# Altium schematic sheet Base Board.SchDoc
size A2; SheetNumber: 1; SheetTotal: 1
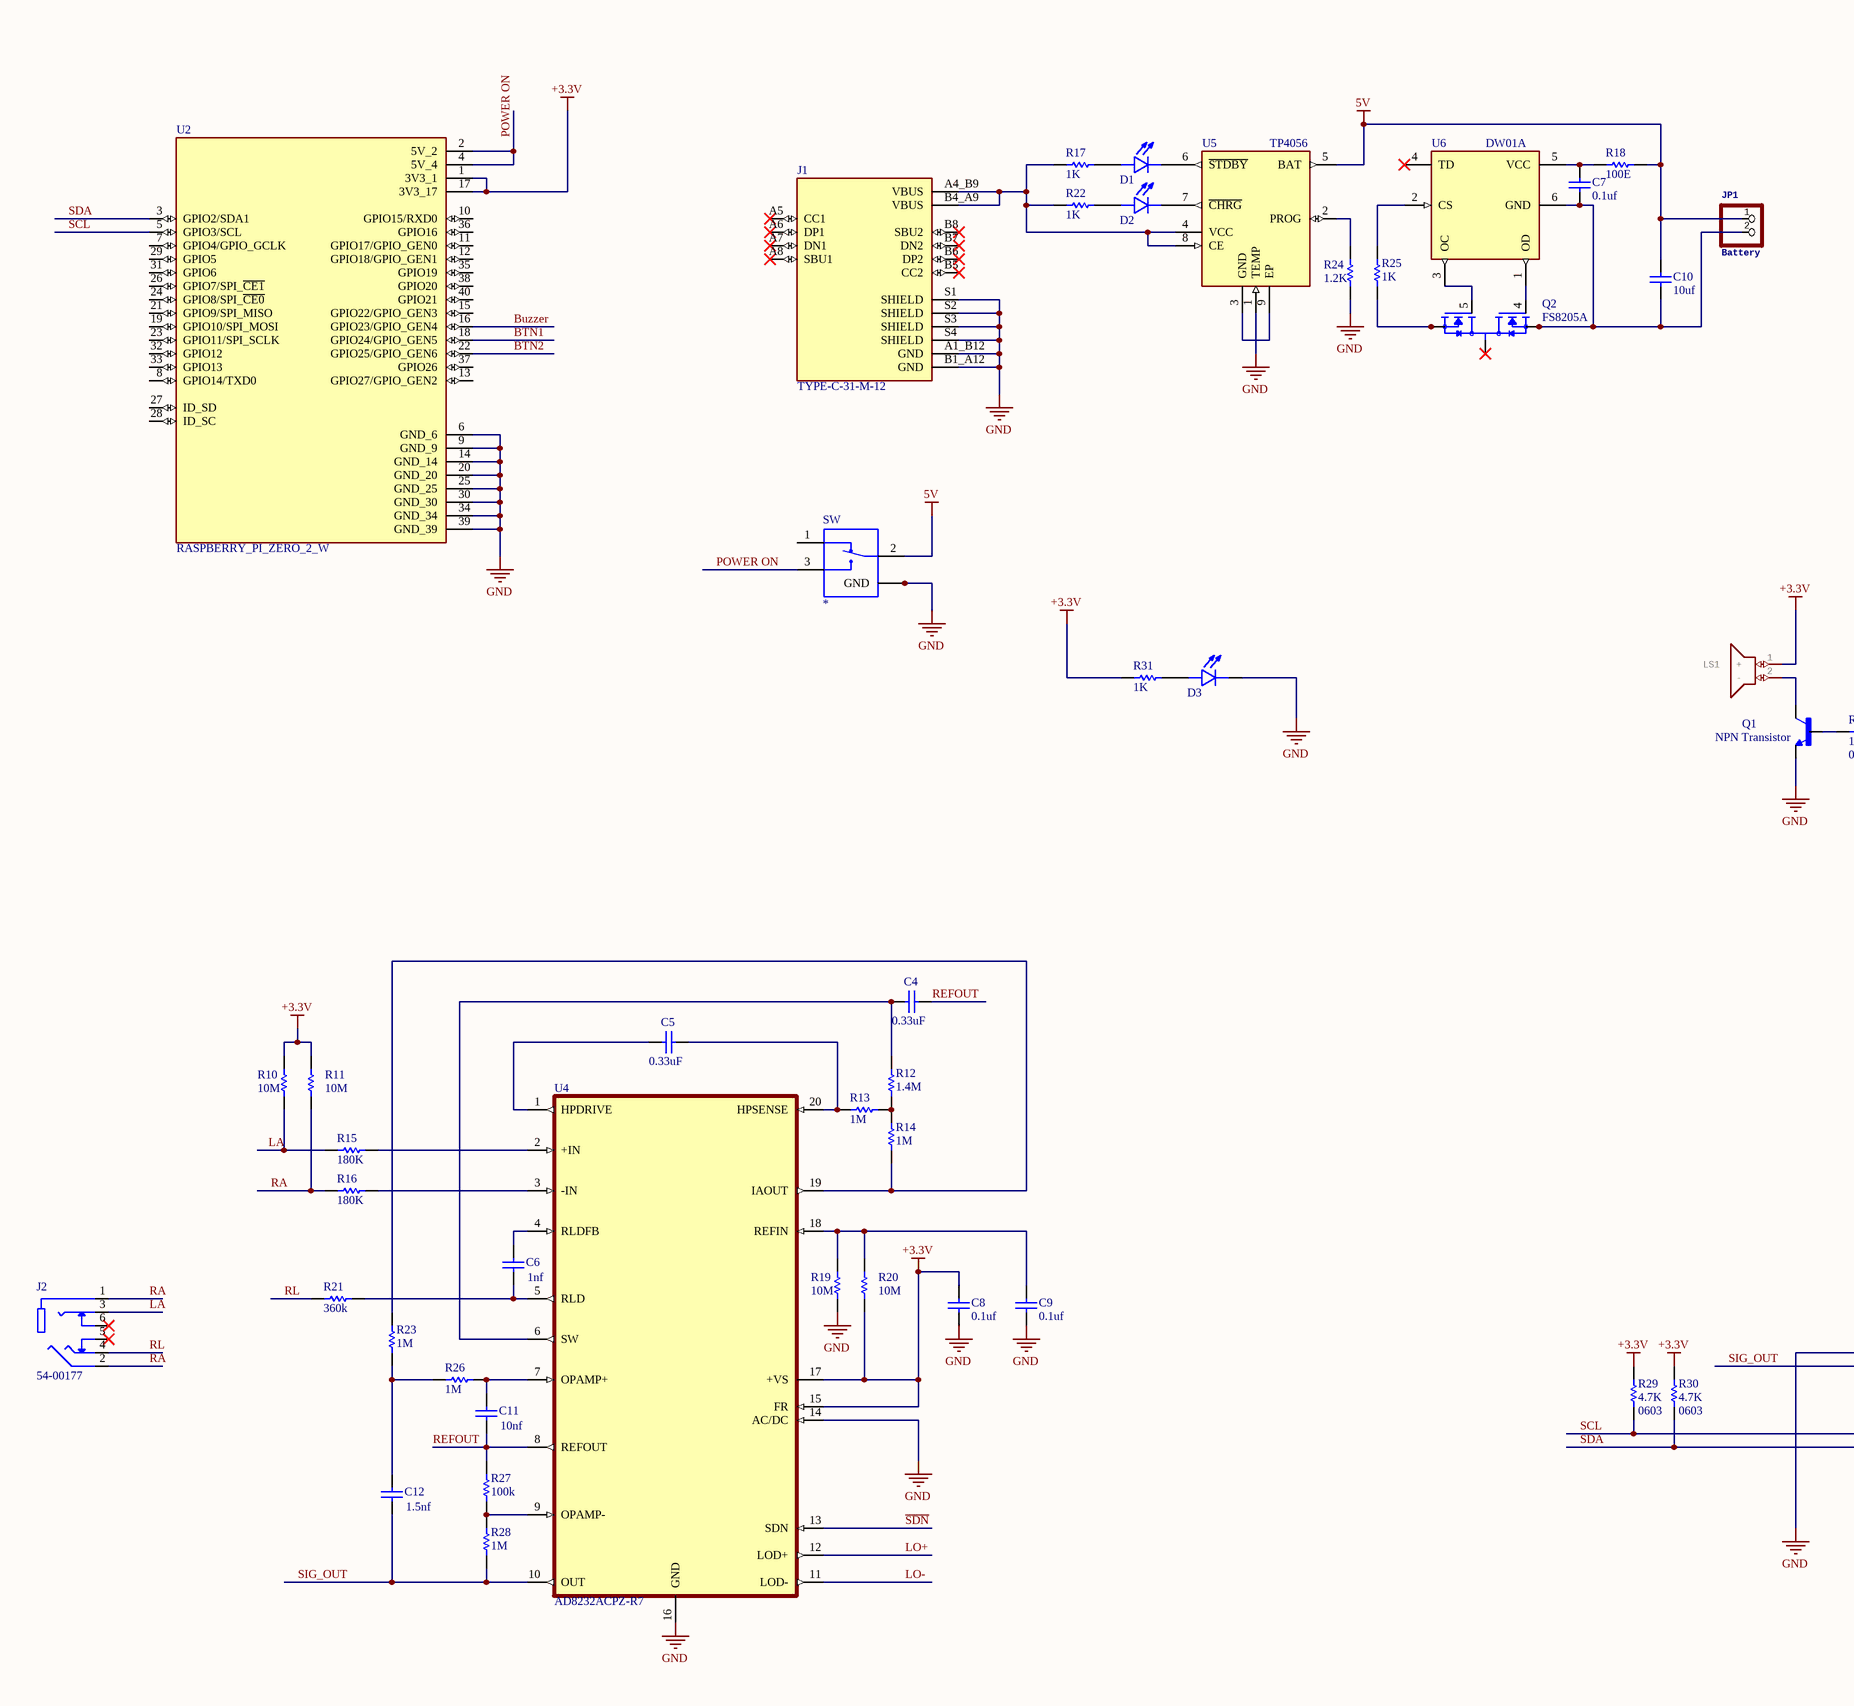
[diagram p0: Base Board.SchDoc, left]
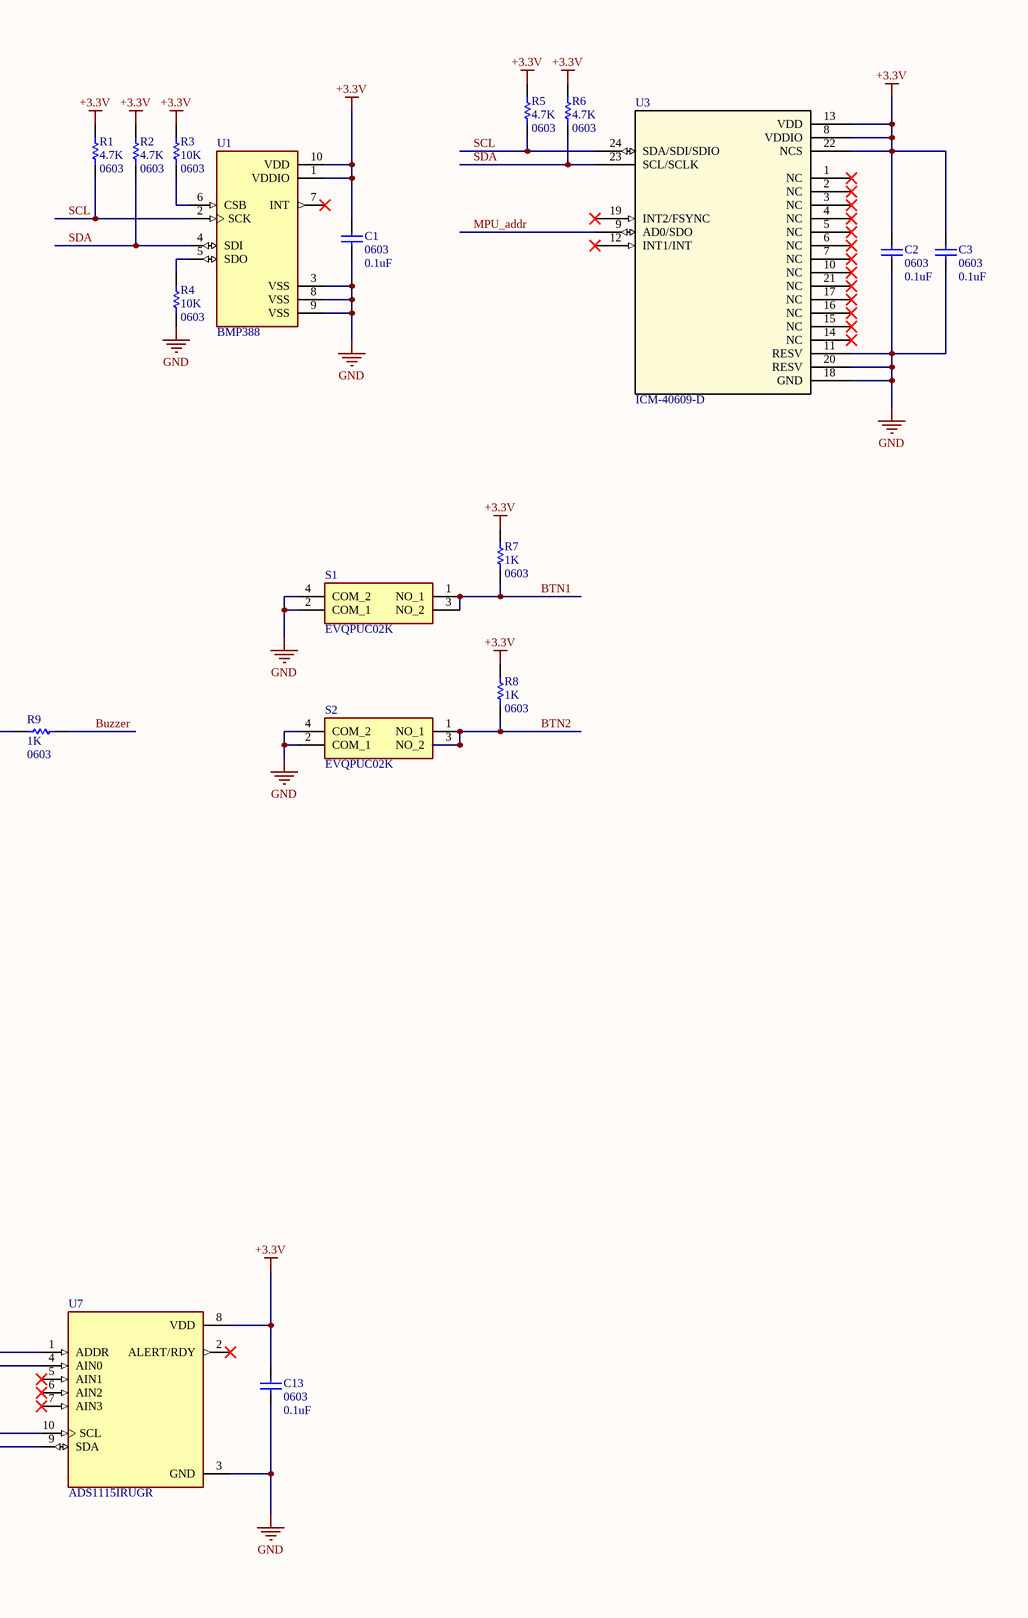
[diagram p1: Base Board.SchDoc, right]

## Parts
C1  Package: 0603  [CAPC1608X90]  (hidden comment: 0.1uF)
C2  Package: 0603  [CAPC1608X90]  (hidden comment: 0.1uF)
C3  Package: 0603  [CAPC1608X90]  (hidden comment: 0.1uF)
C4  0.33uF  [CAPC1608X90]
C5  0.33uF  [CAPC1608X90]
C6  1nf  [CAPC1608X90]
C7  0.1uf  [CAPC1608X90]
C8  0.1uf  [CAPC1608X90]
C9  0.1uf  [CAPC1608X90]
C10  10uf  [CAPC1608X90]
C11  10nf  [CAPC1608X90]
C12  1.5nf  [CAPC1608X90]
C13  Package: 0603  [CAPC1608X90]  (hidden comment: 0.1uF)
D1  KP-1608SURCK  [LED_KP-1608SURCK]  (value not drawn)
D2  KP-1608SURCK  [LED_KP-1608SURCK]  (value not drawn)
D3  KP-1608SURCK  [LED_KP-1608SURCK]  (value not drawn)
J1  TYPE-C-31-M-12  [HRO_TYPE-C-31-M-12]
J2  54-00177  [TENSILITY_54-00177]
JP1  Battery  [1X02]
LS1  Speakers & Transducers 9.0 mm square 1.9 mm deep P 4.0 kHz 3 V SMT no driving circuit T&R package B   Source:  Datasheet  [CPT9019BSMTTR]  (value not drawn)
Q1  NPN Transistor  [SOT100P230X110-3N]
Q2  FS8205A  [SOP65P640X120-8N]
R1  Package: 0603  [R0603]  (hidden comment: 4.7K)
R2  Package: 0603  [R0603]  (hidden comment: 4.7K)
R3  Package: 0603  [R0603]  (hidden comment: 10K)
R4  Package: 0603  [R0603]  (hidden comment: 10K)
R5  Package: 0603  [R0603]  (hidden comment: 4.7K)
R6  Package: 0603  [R0603]  (hidden comment: 4.7K)
R7  Package: 0603  [R0603]  (hidden comment: 1K)
R8  Package: 0603  [R0603]  (hidden comment: 1K)
R9  Package: 0603  [R0603]  (hidden comment: 1K)
R10  10M  [R0603]
R11  10M  [R0603]
R12  1.4M  [R0603]
R13  1M  [R0603]
R14  1M  [R0603]
R15  180K  [R0603]
R16  180K  [R0603]
R17  1K  [R0603]
R18  100E  [R0603]
R19  10M  [R0603]
R20  10M  [R0603]
R21  360k  [R0603]
R22  1K  [R0603]
R23  1M  [R0603]
R24  1.2K  [R0603]
R25  1K  [R0603]
R26  1M  [R0603]
R27  100k  [R0603]
R28  1M  [R0603]
R29  Package: 0603  [R0603]  (hidden comment: 4.7K)
R30  Package: 0603  [R0603]  (hidden comment: 4.7K)
R31  1K  [R0603]
S1  EVQPUC02K  [EVQPUC02K]
S2  EVQPUC02K  [EVQPUC02K]
SW  1437575-1  [SW_MLL1200S]  (value not drawn)
U1  BMP388  [PQFN50P200X200X80-10N]
U2  RASPBERRY_PI_ZERO_2_W  [MODULE_RASPBERRY_PI_ZERO_2_W]
U3  ICM-40609-D  [LGA24_ICM-40609_IVS]
U4  AD8232ACPZ-R7  [QFN50P400X400X100-21N]
U5  TP4056  [SOP127P600X175-9N]
U6  DW01A  [SOT95P280X145-6N]
U7  ADS1115IRUGR  [IC_ADS1115IRUGR]

## Nets
5V: C10.2 JP1.1 R18.1 SW.2 U5.5(BAT)
+3.3V: C1.1 C2.1 C3.1 C8.2 C13.1 LS1.1(+) R1.2 R2.2 R3.2 R5.2 R6.2 R7.1 R8.1 R10.1 R11.1 R20.2 R29.2 R30.2 R31.1 U1.1(VDDIO) U1.10(VDD) U2.1(3V3_1) U2.17(3V3_17) U3.8(VDDIO) U3.13(VDD) U3.22(NCS) U4.15(FR) U4.17(+VS) U7.8(VDD)
GND: C1.2 C2.2 C3.2 C8.1 C9.1 C13.2 D3.2(C) J1.A1_B12(GND) J1.B1_A12(GND) J1.S1(SHIELD) J1.S2(SHIELD) J1.S3(SHIELD) J1.S4(SHIELD) Q1.1(E) R4.1 R19.2 R24.1 S1.2(COM_1) S1.4(COM_2) S2.2(COM_1) S2.4(COM_2) SW.G1(GND) SW.G2(GND) SW.G3(GND) SW.G4(GND) U1.3(VSS) U1.8(VSS) U1.9(VSS) U2.6(GND_6) U2.9(GND_9) U2.14(GND_14) U2.20(GND_20) U2.25(GND_25) U2.30(GND_30) U2.34(GND_34) U2.39(GND_39) U3.11(RESV) U3.18(GND) U3.20(RESV) U4.14(AC/DC) U4.16(GND) U5.1(TEMP) U7.1(ADDR) U7.3(GND)
BTN1: R7.2 S1.1(NO_1) S1.3(NO_2) U2.18(GPIO24/GPIO_GEN5)
BTN2: R8.2 S2.1(NO_1) S2.3(NO_2) U2.22(GPIO25/GPIO_GEN6)
Buzzer: R9.1 U2.16(GPIO23/GPIO_GEN4)
LA: J2.3 R10.2 R15.2
LO+: U4.12(LOD+)
LO-: U4.11(LOD-)
MPU_addr: U3.9(AD0/SDO)
POWER ON: SW.3 U2.2(5V_2) U2.4(5V_4)
RA: J2.1 J2.2 R11.2 R16.2
REFOUT: C4.2 C11.1 R27.2 U4.8(REFOUT)
RL: J2.4 R21.2
~{SDN}: U4.13(SDN)
SCL: R1.1 R5.1 R29.1 U1.2(SCK) U2.5(GPIO3/SCL) U3.24(SDA/SDI/SDIO) U7.10(SCL)
SDA: R2.1 R6.1 R30.1 U1.4(SDI) U2.3(GPIO2/SDA1) U3.23(SCL/SCLK) U7.9(SDA)
SIG_OUT: C12.1 R28.1 U4.10(OUT) U7.4(AIN0)
NetC4_1: C4.1 R12.1 U4.6(SW)
NetC5_1: C5.1 U4.1(HPDRIVE)
NetC5_2: C5.2 R13.2 U4.20(HPSENSE)
NetC6_1: C6.1 R21.1 U4.5(RLD)
NetC6_2: C6.2 U4.4(RLDFB)
NetC7_1: C7.1 C10.1 JP1.2 Q2.2(S1) Q2.3(S1) U6.6(GND)
NetC7_2: C7.2 R18.2 U6.5(VCC)
NetC9_2: C9.2 R19.1 R20.1 U4.18(REFIN)
NetC11_2: C11.2 R26.2 U4.7(OPAMP+)
NetC12_2: C12.2 R23.1 R26.1
NetD1_1: D1.1(A) R17.2
NetD1_2: D1.2(C) U5.6(~{STDBY})
NetD2_1: D2.1(A) R22.2
NetD2_2: D2.2(C) U5.7(~{CHRG})
NetD3_1: D3.1(A) R31.2
NetJ1_A4_B9: J1.A4_B9(VBUS) J1.B4_A9(VBUS) R17.1 R22.1 U5.4(VCC) U5.8(CE)
NetLS1_2: LS1.2(-) Q1.3(C)
NetQ1_2: Q1.2(B) R9.2
NetQ2_1: Q2.1(D12) Q2.8(D12)
NetQ2_4: Q2.4(G1) U6.1(OD)
NetQ2_5: Q2.5(G2) U6.3(OC)
NetQ2_6: Q2.6(S2) Q2.7(S2) R25.1
NetR3_1: R3.1 U1.6(CSB)
NetR4_2: R4.2 U1.5(SDO)
NetR12_2: R12.2 R13.1 R14.2
NetR14_1: R14.1 R23.2 U4.19(IAOUT)
NetR15_1: R15.1 U4.2(+IN)
NetR16_1: R16.1 U4.3(-IN)
NetR24_2: R24.2 U5.2(PROG)
NetR25_2: R25.2 U6.2(CS)
NetR27_1: R27.1 R28.2 U4.9(OPAMP-)
NetU5_3: U5.3(GND) U5.9(EP)

Not connected (* = marked no-connect by the designer): J1 A5(CC1)* A6(DP1)* A7(DN1)* A8(SBU1)* B5(CC2)* B6(DP2)* B7(DN2)* B8(SBU2)*; J2 5* 6*; SW 1; U1 7(INT)*; U2 7(GPIO4/GPIO_GCLK) 8(GPIO14/TXD0) 10(GPIO15/RXD0) 11(GPIO17/GPIO_GEN0) 12(GPIO18/GPIO_GEN1) 13(GPIO27/GPIO_GEN2) 15(GPIO22/GPIO_GEN3) 19(GPIO10/SPI_MOSI) 21(GPIO9/SPI_MISO) 23(GPIO11/SPI_SCLK) 24(GPIO8/SPI_~{CE0}) 26(GPIO7/SPI_~{CE1}) 27(ID_SD) 28(ID_SC) 29(GPIO5) 31(GPIO6) 32(GPIO12) 33(GPIO13) 35(GPIO19) 36(GPIO16) 37(GPIO26) 38(GPIO20) 40(GPIO21); U3 1(NC)* 2(NC)* 3(NC)* 4(NC)* 5(NC)* 6(NC)* 7(NC)* 10(NC)* 12(INT1/INT)* 14(NC)* 15(NC)* 16(NC)* 17(NC)* 19(INT2/FSYNC)* 21(NC)*; U6 4(TD)*; U7 2(ALERT/RDY)* 5(AIN1)* 6(AIN2)* 7(AIN3)*

## Library data of the parts
C1-C3 C13 = C0603: MF: *; Digi-Key_Part_Number: *; MP: *; Value: 0.1uF
C4-C12 = C0603: MF: Murata Electronics; MP: GCM188R71C334KA37D; Digi-Key_Part_Number: 490-6050-2-ND; Package: 0603
  C4 C5: Value: 0.33uF
  C6: Value: 1nf
  C7-C9: Value: 0.1uf
  C10: Value: 10uf
  C11: Value: 10nf
  C12: Value: 1.5nf
D1-D3 = KP-1608SURCK: LED; SMD; 0603; red; 50-150mcd; 1.6x0.8mm; 120Â°; 20mA;; MF: Kingbright; SnapEDA_Link: https://www.snapeda.com/parts/KP-1608SURCK/Kingbright/view-part/?ref=snap; Package: 0603 Kingbright; Value: *; MP: KP-1608SURCK; Check_prices: https://www.snapeda.com/parts/KP-1608SURCK/Kingbright/view-part/?ref=eda
J1 = TYPE-C-31-M-12: USB Connectors 24 Receptacle 1 8.94*7.3mm RoHS; Manufacturer: HRO Electronics Co., Ltd.; Value: USB-C 16 pins; Other: USB 2 data interface; Man. PN: TYPE-C-31-M-12; Supplier: LCSC; Supplier PN: C165948
J2 = 54-00177: Connector, 4C audio jack, 3.5xL14 mm, SMT mount, gold plated; MF: Tensility International Corp; Package: None; Price: None; Check_prices: https://www.snapeda.com/parts/54-00177/Tensility+International+Corp/view-part/?ref=eda; Value: *; SnapEDA_Link: https://www.snapeda.com/parts/54-00177/Tensility+International+Corp/view-part/?ref=snap; MP: 54-00177; Availability: In Stock; Purchase-URL: https://pricing.snapeda.com/search?q=54-00177&ref=eda
JP1 = PINHD-1X2
LS1 = CPT-9019B-SMT-TR: Manufacturer_Name: Same Sky; GateName_1: G$1; SymbolName_1: CPT-9019B-SMT-TR; LibraryName: CPT-9019B-SMT-TR; DeviceSetName: CPT-9019B-SMT-TR; Package: CPT9019BSMTTR; Manufacturer_Part_Number: CPT-9019B-SMT-TR; Mouser_Part_Number: 179-CPT-9019B-SMT-TR; Mouser_Price-Stock: https://www.mouser.co.uk/ProductDetail/CUI-Devices/CPT-9019B-SMT-TR?qs=3Rah4i%252BhyCGQOzp5C27TLw%3D%3D; Height: 2.1mm
Q1 = BC847B: Bipolar (BJT) Transistor NPN 45V 100mA 100MHz 150mW Surface Mount SOT-523; Manufacturer1: STMicroelectronics; Package: None; Price: None; Availability: Unavailable; Manfacturer Part Number1: BC847B; Value: *
Q2 = FS8205A: N/A; MF: Fortune Semiconductor; MP: FS8205A; Value: *; Availability: Not in stock; Package: Package; Price: None; SnapEDA_Link: https://www.snapeda.com/parts/FS8205A/Fortune+Semiconductor/view-part/?ref=snap; Check_prices: https://www.snapeda.com/parts/FS8205A/Fortune+Semiconductor/view-part/?ref=eda
R1-R31 = R0603: MF: *; MP: *; LCSC Part: *; Mouser Part: *; Digikey Part: *
  R1 R2 R5 R6 R29 R30: Value: 4.7K
  R3 R4: Value: 10K
  R7-R9: Value: 1K
  R10 R11 R19 R20: Value: 10M; Package: 0603
  R12: Value: 1.4M; Package: 0603
  R13 R14 R23 R26 R28: Value: 1M; Package: 0603
  R15 R16: Value: 180K; Package: 0603
  R17 R22 R25 R31: Value: 1K; Package: 0603
  R18: Value: 100E; Package: 0603
  R21: Value: 360k; Package: 0603
  R24: Value: 1.2K; Package: 0603
  R27: Value: 100k; Package: 0603
S1 S2 = EVQPUC02K: Switch; Manufacturer: Panasonic; Value: PB+NO; Other: Pushbutton edge SMT; Man. PN: EVQPUC02K; Supplier: LCSC; Supplier PN: C79174
SW = MLL1200S: Slide Switch SPDT Surface Mount, Right Angle; MF: TE Connectivity; Value: *; Package: None; Digi-Key_Purchase_URL: https://www.digikey.lt/product-detail/en/te-connectivity-alcoswitch-switches/MLL1200S/450-1577-ND/1201378?utm_source=snapeda&utm_medium=aggregator&utm_campaign=symbol; Digi-Key_Part_Number: 450-1577-ND; TE_purchase_URL: https://www.te.com/usa-en/product-1437575-1.html?te_bu=Cor&te_type=disp&te_campaign=seda_glo_cor-seda-global-disp-prtnr-fy19-seda-model-bom-cta_sma-317_1&elqCampaignId=32493; SnapEDA_Link: https://www.snapeda.com/parts/MLL1200S/TE%20Connectivity%20ALCOSWITCH%20Switches/view-part/1494234/?ref=snap; MP: MLL1200S; Comment_1: *
U1 = BMP388: P-Sensor SPI I2C 1, 25 Bar SMD; Package: None; Price: None; Value: *; MP: BMP388; Availability: Unavailable
U2 = RASPBERRY_PI_ZERO_2_W: At the heart of Raspberry Pi Zero 2 W is RP3A0, a custom-built system-in-package designed by Raspberry Pi in the UK.; SnapEDA_Link: https://www.snapeda.com/parts/RASPBERRY%20PI%20ZERO%202%20W/Raspberry+Pi/view-part/?ref=snap; Package: None; Value: *; MF: Raspberry Pi; MP: RASPBERRY PI ZERO 2 W; Check_prices: https://www.snapeda.com/parts/RASPBERRY%20PI%20ZERO%202%20W/Raspberry+Pi/view-part/?ref=eda
U3 = ICM-40609-D: No Description Available; Mfr_Name: InvenSense; Type: Motion Sensors; RefDes: RefDes
U4 = AD8232ACPZ-R7: None; MF: {'manufacturer': u'Analog Devices Inc.'}; Package: None; Price: None; Value: *; MP: AD8232ACPZ-R7; Availability: Unavailable
U5 = TP4056: Complete single cell Li-Ion battery with a constant current / constant voltage linear charger; MF: NanJing Top Power ASIC Corp.; Check_prices: https://www.snapeda.com/parts/TP4056/NanJing+Top+Power+ASIC+Corp./view-part/?ref=eda; SnapEDA_Link: https://www.snapeda.com/parts/TP4056/NanJing+Top+Power+ASIC+Corp./view-part/?ref=snap; Price: None; Availability: Not in stock; Package: Package; MP: TP4056; Value: *
U6 = DW01A: One Cell Lithium-ion/Polymer Battery Protection IC; MF: Fortune Semiconductor; SnapEDA_Link: https://www.snapeda.com/parts/DW01A/Fortune+Semiconductor/view-part/?ref=snap; Package: SOT-23-6 Fortune Semiconductor; Value: *; MP: DW01A; Check_prices: https://www.snapeda.com/parts/DW01A/Fortune+Semiconductor/view-part/?ref=eda
U7 = ADS1115IRUGR: 16-bit, 860-SPS, 4-channel, delta-sigma ADC with PGA, oscillator, VREF, comparator and I2C; MF: Texas Instruments; Availability: In Stock; SnapEDA_Link: https://www.snapeda.com/parts/ADS1115IRUGR/Texas+Instruments/view-part/?ref=snap; Check_prices: https://www.snapeda.com/parts/ADS1115IRUGR/Texas+Instruments/view-part/?ref=eda; Value: *; Package: X2QFN-10 Texas Instruments; Purchase-URL: https://pricing.snapeda.com/search/part/ADS1115IRUGR/?ref=eda; MP: ADS1115IRUGR; Price: None